# Altium schematic sheet STeaMi-FP9-Bouton_de_controle.SchDoc
size A3; DocumentNumber: 1; SheetNumber: 10; SheetTotal: 16
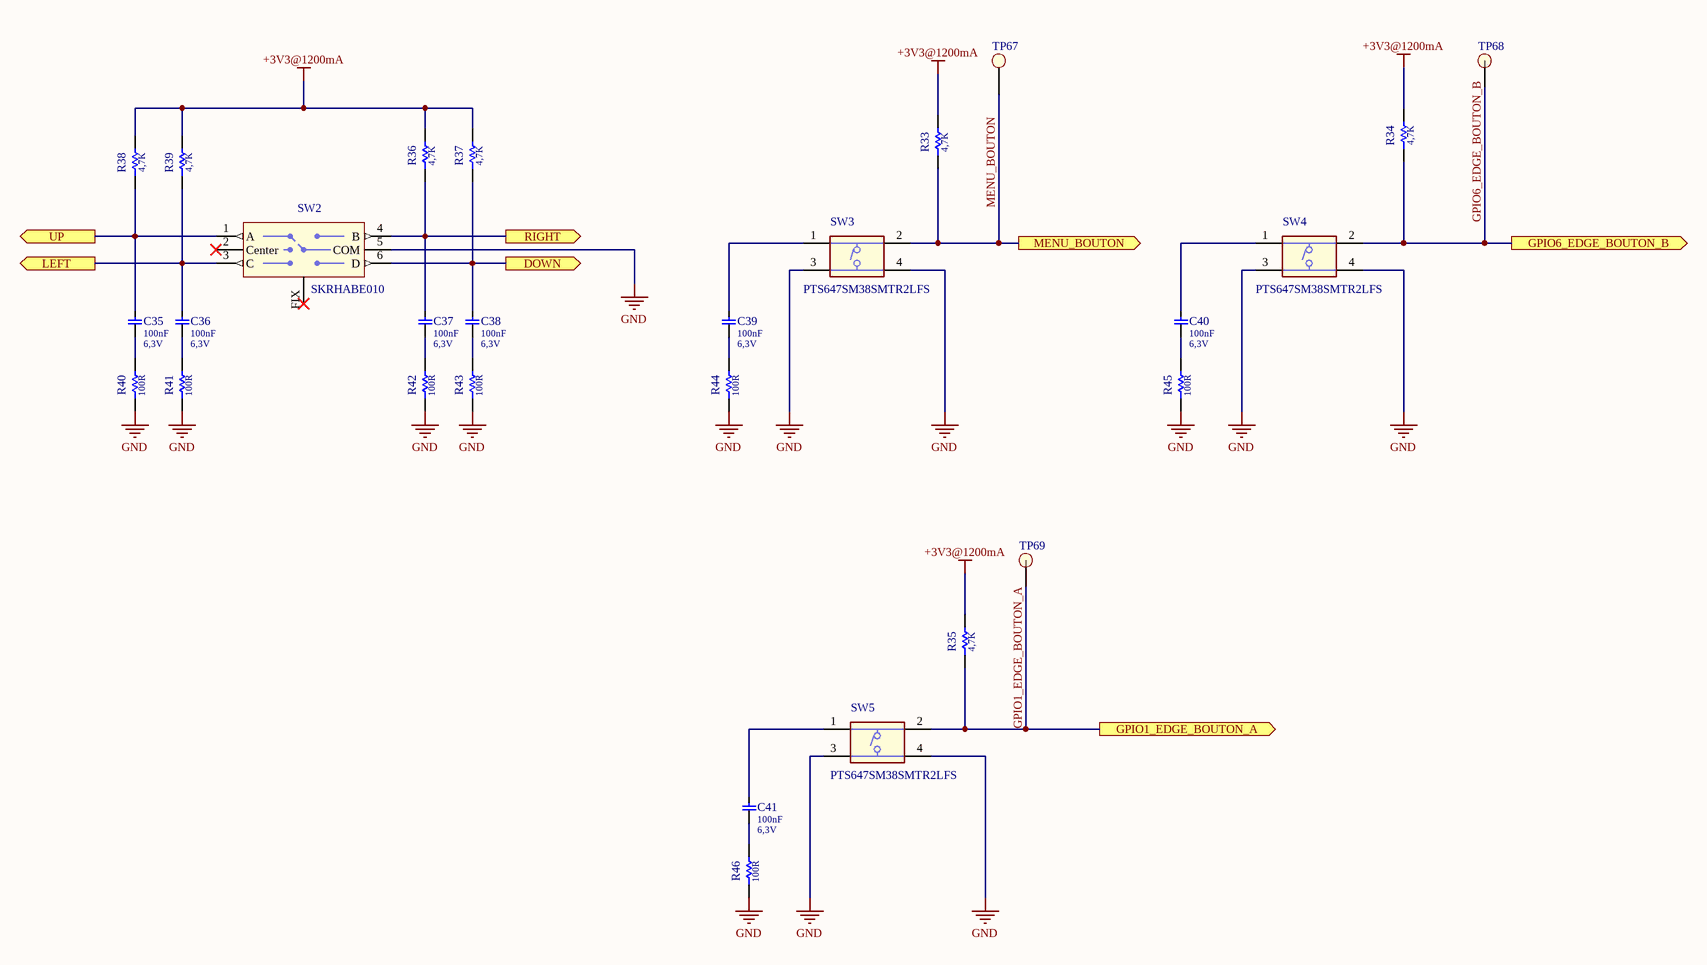
[diagram p0: STeaMi-FP9-Bouton_de_controle.SchDoc]

## Parts
C35  Capacitance: 100nF  Voltage: 6,3V  [0402-CAP]
C36  Capacitance: 100nF  Voltage: 6,3V  [0402-CAP]
C37  Capacitance: 100nF  Voltage: 6,3V  [0402-CAP]
C38  Capacitance: 100nF  Voltage: 6,3V  [0402-CAP]
C39  Capacitance: 100nF  Voltage: 6,3V  [0402-CAP]
C40  Capacitance: 100nF  Voltage: 6,3V  [0402-CAP]
C41  Capacitance: 100nF  Voltage: 6,3V  [0402-CAP]
R33  Resistance: 4,7K  [RESC1005X40N_0402]
R34  Resistance: 4,7K  [RESC1005X40N_0402]
R35  Resistance: 4,7K  [RESC1005X40N_0402]
R36  Resistance: 4,7K  [RESC1005X40N_0402]
R37  Resistance: 4,7K  [RESC1005X40N_0402]
R38  Resistance: 4,7K  [RESC1005X40N_0402]
R39  Resistance: 4,7K  [RESC1005X40N_0402]
R40  Resistance: 100R  [RESC1005X40N_0402]
R41  Resistance: 100R  [RESC1005X40N_0402]
R42  Resistance: 100R  [RESC1005X40N_0402]
R43  Resistance: 100R  [RESC1005X40N_0402]
R44  Resistance: 100R  [RESC1005X40N_0402]
R45  Resistance: 100R  [RESC1005X40N_0402]
R46  Resistance: 100R  [RESC1005X40N_0402]
SW2  (no value)  [SKRHABE010]
SW3  (no value)  [PTS647SM38SMTR2LFS]
SW4  (no value)  [PTS647SM38SMTR2LFS]
SW5  (no value)  [PTS647SM38SMTR2LFS]
TP67  PAD  [Testpoint 1mm]  (value not drawn)  (no BOM)
TP68  PAD  [Testpoint 1mm]  (value not drawn)  (no BOM)
TP69  PAD  [Testpoint 1mm]  (value not drawn)  (no BOM)

## Ports
DOWN (out), GPIO1_EDGE_BOUTON_A (out), GPIO6_EDGE_BOUTON_B (out), LEFT (out), MENU_BOUTON (out), RIGHT (out), UP (out)

## Nets
+3V3@1200mA: R33.2 R34.2 R35.2 R36.2 R37.2 R38.2 R39.2
GND: R40.1 R41.1 R42.1 R43.1 R44.1 R45.1 R46.1 SW2.5(COM) SW3.3 SW3.4 SW4.3 SW4.4 SW5.3 SW5.4
DOWN: C38.2 R37.1 SW2.6(D) ; port DOWN
GPIO1_EDGE_BOUTON_A: R35.1 SW5.2 TP69.1 ; port GPIO1_EDGE_BOUTON_A
GPIO6_EDGE_BOUTON_B: R34.1 SW4.2 TP68.1 ; port GPIO6_EDGE_BOUTON_B
LEFT: C36.2 R39.1 SW2.3(C) ; port LEFT
MENU_BOUTON: R33.1 SW3.2 TP67.1 ; port MENU_BOUTON
RIGHT: C37.2 R36.1 SW2.4(B) ; port RIGHT
UP: C35.2 R38.1 SW2.1(A) ; port UP
NetC35_1: C35.1 R40.2
NetC36_1: C36.1 R41.2
NetC37_1: C37.1 R42.2
NetC38_1: C38.1 R43.2
NetC39_1: C39.1 R44.2
NetC39_2: C39.2 SW3.1
NetC40_1: C40.1 R45.2
NetC40_2: C40.2 SW4.1
NetC41_1: C41.1 R46.2
NetC41_2: C41.2 SW5.1

Not connected (* = marked no-connect by the designer): SW2 2(Center)* FIX*

## Notes on the sheet
- Le présent document est la propriété exclusive de SmartEmbed. Remis à titre confidentiel, il ne peut être communiqué
- IND
- DATE
- DESCRIPTION
- VISA
- à des tiers, ni utilisé ou reproduit qu'en stricte conformité d'autorisations expresses préalables.
- Etabli le:
- Verifié le:
- Validé le:
- Par:
- Page:
- /
- Pépinière CleanTech Domaine du Petit Arbois Avenue Louis Philibert BP 80058 13792 AIX-EN-PROVENCE CEDEX 3
- REFERENCE
- DESIGNATION

## Library data of the parts
C35-C41 = 100nF-10%-6,3V-X5R-0402: CAP CER 100nF 6,3V X5R 0402; Manufacturer: Kyocera AVX; Manufacturer Part Number: 0402YD104KAT2A; Populated: True; std Package: 0402; Tolerence: 0,1; Vérification: Non; Created by: EAG; Creation Date: 18/10/2021; Checked by: *; Part Number: 100nF-10%-6,3V-X5R-0402; Dielectric: X5R; Digikey: 478-1126-1-ND; Mouser: 581-0402YD104K; Switch possibility: True
R33-R39 = 4,7K-5%-0,0625W-0402: RES CMS 4,7K5%-0,0625W-0402 ±100ppm/°C; Manufacturer: Yageo; Manufacturer Part Number: AC0402JR-074K7L; Populated: True; Power: 0,0625; Nom vérificateur: Non; Prix: 0,09; std Package: 0402; Tolerence: 0,05; Created by: EAG; Creation Date: 02/12/2021; Part Number: 4,7K-5%-0,0625W-0402; Digikey: 311-4.7KLBDKR-ND; Farnell: 3495221; Mouser: 603-AC0402JR-074K7L; Switch possibility: True
R40-R46 = 100R-5%-0,0625W-0402: RES CMS 100R5%-0,0625W-0402 ±100ppm/°C; Manufacturer: Yageo; Manufacturer Part Number: RC0402JR-07100RL; Populated: True; Power: 0,0625; Nom vérificateur: Non; Prix: 0,09; std Package: 0402; Tolerence: 0,05; Created by: EAG; Creation Date: 02/12/2021; Part Number: 100R-5%-0,0625W-0402; Digikey: 311-100JRCT-ND; Farnell: 9232648; Switch possibility: True
SW2 = SKRHABE010: 4-direction type with center-push function; Manufacturer: ALPS; Populated: True; Switch possibility: False; Vérification: Non; Created by: EAG; Creation Date: 13/09/2021; Checked by: *; Manufacturer Part Number: SKRHABE010; Part Number: SKRHABE010; Mouser: 688-SKRHAB
SW3-SW5 = PTS647SM38SMTR2LFS: Interrupteurs de contact 50mA 12VDC, 1.8N 3.8mm H, G leads; Manufacturer: C&K; Populated: True; Switch possibility: False; Vérification: Non; Created by: EAG; Creation Date: 14/09/2021; Checked by: *; Manufacturer Part Number: PTS647SM38SMTR2LFS; Part Number: PTS647SM38SMTR2LFS; Mouser: 611-PTS647SM38SMTR2L
TP67-TP69 = TESTPOINTPAD: Manufacturer: SmartEmbed; Package: PAD_TEST; Part Number: TESTPOINTPAD